# EAGLE design R2P_IR_module (EAGLE 6.2)
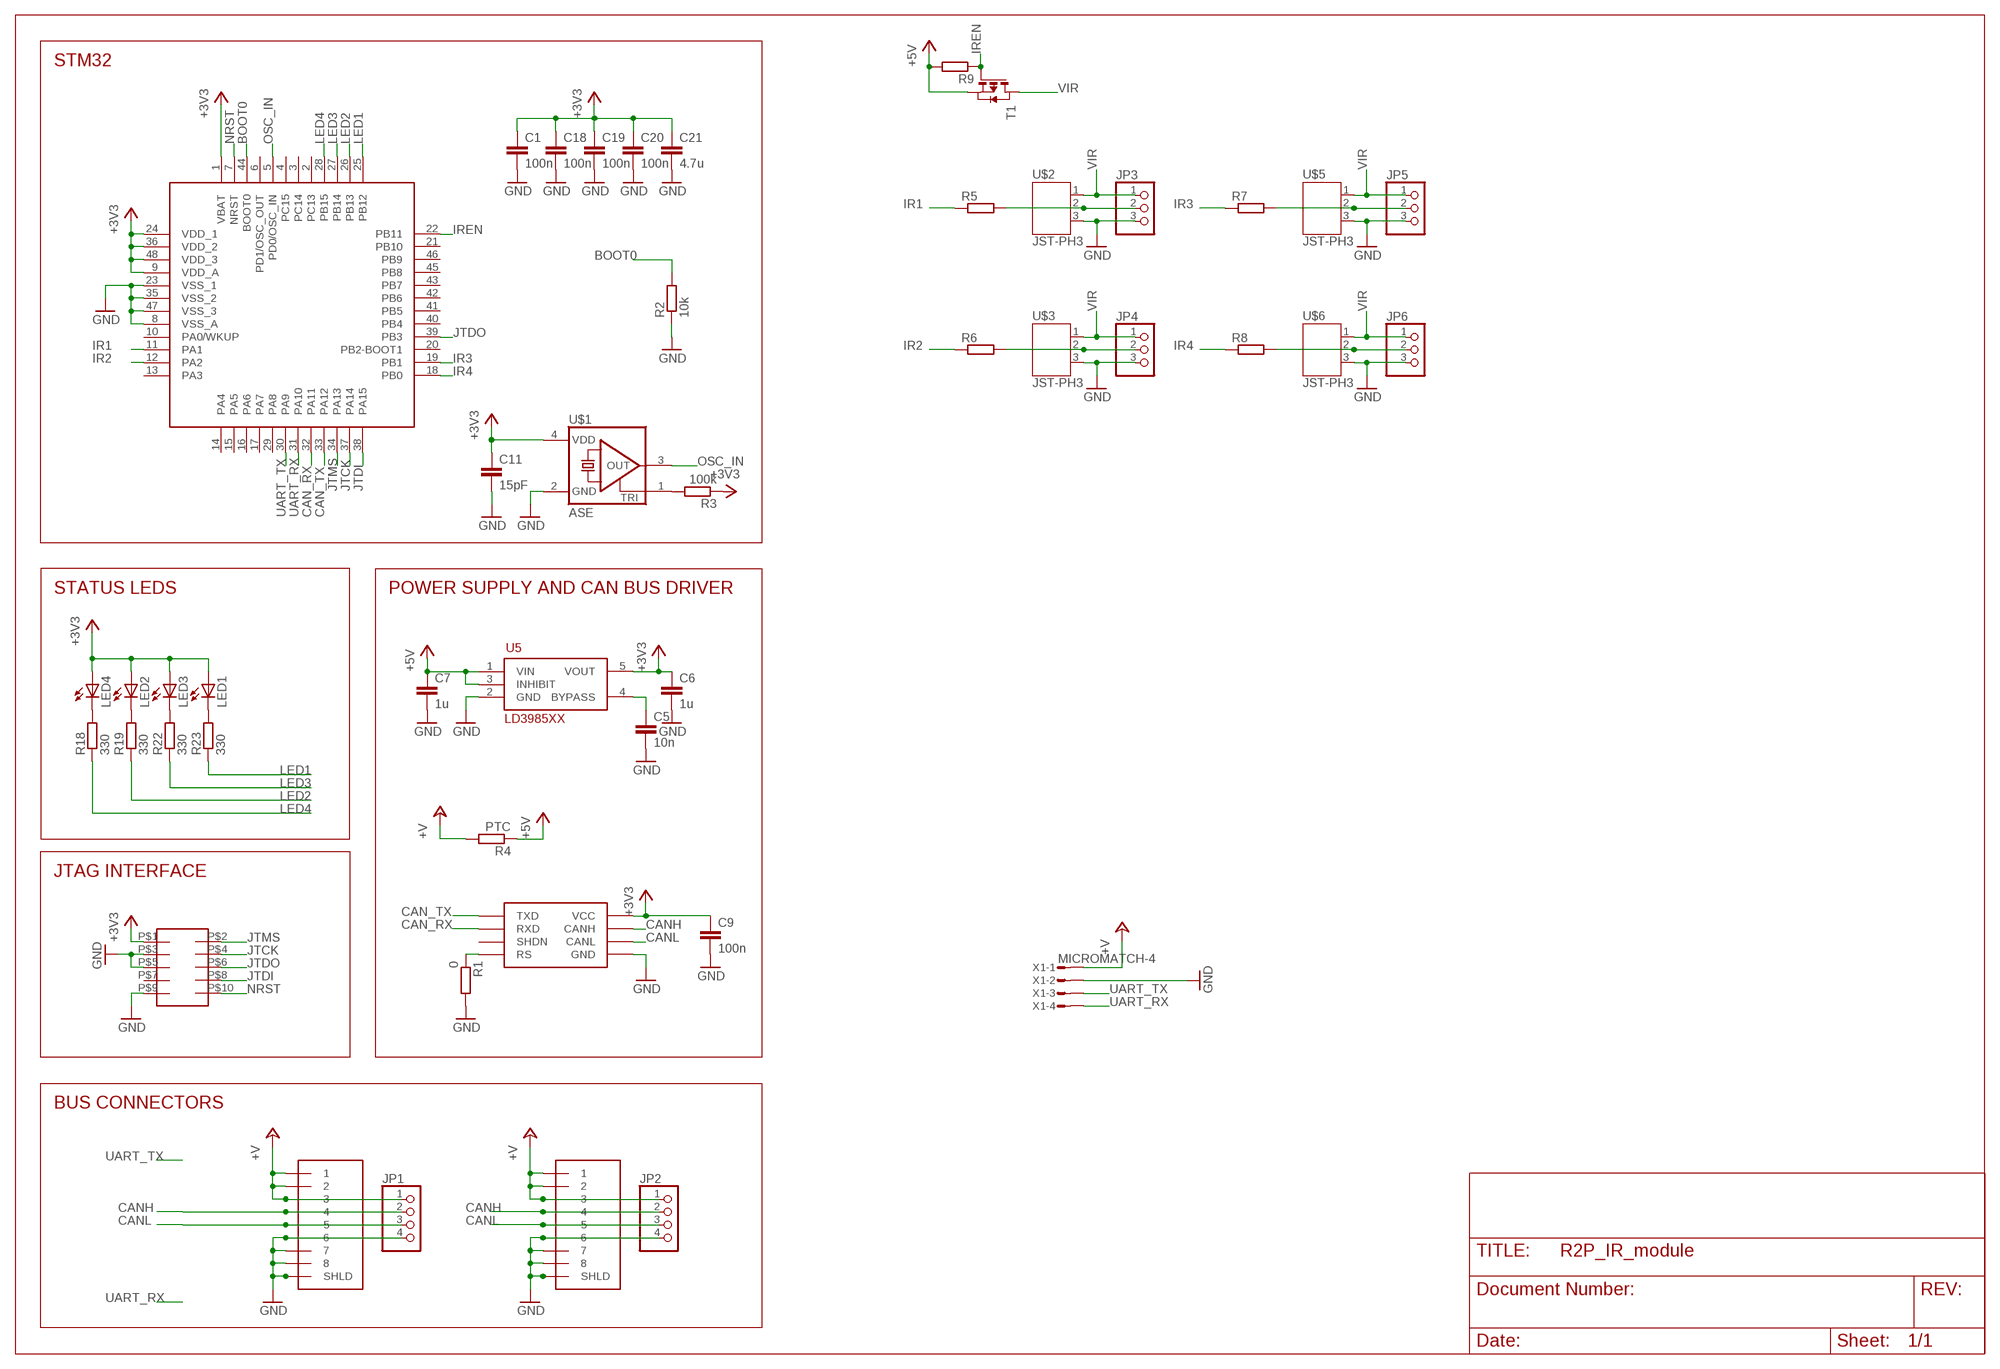
[diagram p0: schematic, sheet 1]

## Parts
1  RJ45-43860  [0438600010]
2  RJ45-43860  [0438600010]
C1  100n  C-EUC0603  [C0603]
C5  10n  C-EUC0603  [C0603]
C6  1u  C-EUC0603  [C0603]
C7  1u  C-EUC0603  [C0603]
C9  100n  C-EUC0603  [C0603]
C11  15pF  C-EUC0603  [C0603]
C18  100n  C-EUC0603  [C0603]
C19  100n  C-EUC0603  [C0603]
C20  100n  C-EUC0603  [C0603]
C21  4.7u  C-EUC0805  [C0805]
JP1  PINHD-1X4  [1X04]
JP2  PINHD-1X4  [1X04]
JP3  PINHD-1X3  [1X03]
JP4  PINHD-1X3  [1X03]
JP5  PINHD-1X3  [1X03]
JP6  PINHD-1X3  [1X03]
LED1  LEDCHIPLED_0805  [CHIPLED_0805]
LED2  LEDCHIPLED_0805  [CHIPLED_0805]
LED3  LEDCHIPLED_0805  [CHIPLED_0805]
LED4  LEDCHIPLED_0805  [CHIPLED_0805]
R1  0  R-EU_R0603  [R0603]
R2  10k  R-EU_R0603  [R0603]
R3  100k  R-EU_R0603  [R0603]
R4  PTC  R-EU_R0603  [R0603]
R5  R-EU_R0603  [R0603]
R6  R-EU_R0603  [R0603]
R7  R-EU_R0603  [R0603]
R8  R-EU_R0603  [R0603]
R9  R-EU_R0603  [R0603]
R18  330  R-EU_R0603  [R0603]
R19  330  R-EU_R0603  [R0603]
R22  330  R-EU_R0603  [R0603]
R23  330  R-EU_R0603  [R0603]
SOT1  MAX3051  [SOT23-8L]
T1  PMOSSOT23  [SOT-23]
U1  STM32F103CX  [LQFP48]
U5  LD3985XX  [SOT23-5L]
U$1  ASE  [ASE]
U$2  JST-PH3  [JST-PH3]
U$3  JST-PH3  [JST-PH3]
U$4  FTSH-105  [FTSH-105]
U$5  JST-PH3  [JST-PH3]
U$6  JST-PH3  [JST-PH3]
X1  MICROMATCH-4  [MICROMATCH-4]

## Nets
+3V3: C1.1 C6.1 C9.1 C11.1 C18.1 C19.1 C20.1 C21.1 LED1.A LED2.A LED3.A LED4.A R3.1 SOT1.P$3(VCC) U1.1(VBAT) U1.9(VDD_A) U1.24(VDD_1) U1.36(VDD_2) U1.48(VDD_3) U5.5(VOUT) U$1.4(VDD) U$4.P$1
+5V: C7.1 R4.1 R9.2 T1.2(S) U5.1(VIN) U5.3(INHIBIT)
+V: 1.P$1 1.P$2 1.P$3 2.P$1 2.P$2 2.P$3 JP1.1 JP2.1 R4.2 X1.1
BOOT0: R2.2 U1.44(BOOT0)
CAN_RX: SOT1.P$4(RXD) U1.32(PA11)
CAN_TX: SOT1.P$1(TXD) U1.33(PA12)
CANH: 1.P$4 2.P$4 JP1.2 JP2.2 SOT1.P$7(CANH)
CANL: 1.P$5 2.P$5 JP1.3 JP2.3 SOT1.P$6(CANL)
GND: 1.P$6 1.P$7 1.P$8 1.P$9(SHLD) 1.P$10 2.P$6 2.P$7 2.P$8 2.P$9(SHLD) 2.P$10 C1.2 C5.2 C6.2 C7.2 C9.2 C11.2 C18.2 C19.2 C20.2 C21.2 JP1.4 JP2.4 JP3.3 JP4.3 JP5.3 JP6.3 R1.2 R2.1 SOT1.P$2(GND) U1.8(VSS_A) U1.23(VSS_1) U1.35(VSS_2) U1.47(VSS_3) U5.2(GND) U$1.2(GND) U$2.3 U$3.3 U$4.P$3 U$4.P$5 U$4.P$9 U$5.3 U$6.3 X1.2
IR1: R5.1 U1.11(PA1)
IR2: R6.1 U1.12(PA2)
IR3: R7.1 U1.19(PB1)
IR4: R8.1 U1.18(PB0)
IREN: R9.1 T1.3(G) U1.22(PB11)
JTCK: U1.37(PA14) U$4.P$4
JTDI: U1.38(PA15) U$4.P$8
JTDO: U1.39(PB3) U$4.P$6
JTMS: U1.34(PA13) U$4.P$2
LED1: R23.1 U1.25(PB12)
LED2: R19.1 U1.26(PB13)
LED3: R22.1 U1.27(PB14)
LED4: R18.1 U1.28(PB15)
N$2: R1.1 SOT1.P$8(RS)
N$3: R3.2 U$1.1(TRI)
N$4: C5.1 U5.4(BYPASS)
N$5: JP3.2 R5.2 U$2.2
N$6: JP4.2 R6.2 U$3.2
N$7: JP6.2 R8.2 U$6.2
N$8: JP5.2 R7.2 U$5.2
N$15: LED4.C R18.2
N$18: LED2.C R19.2
N$20: LED3.C R22.2
N$22: LED1.C R23.2
NRST: U1.7(NRST) U$4.P$10
OSC_IN: U1.5(PD0/OSC_IN) U$1.3(OUT)
UART_RX: U1.31(PA10) X1.4
UART_TX: U1.30(PA9) X1.3
VIR: JP3.1 JP4.1 JP5.1 JP6.1 T1.1(D) U$2.1 U$3.1 U$5.1 U$6.1
Unconnected: SOT1.P$5(SHDN) U1.2(PC13) U1.3(PC14) U1.4(PC15) U1.6(PD1/OSC_OUT) U1.10(PA0/WKUP) U1.13(PA3) U1.14(PA4) U1.15(PA5) U1.16(PA6) U1.17(PA7) U1.20(PB2-BOOT1) U1.21(PB10) U1.29(PA8) U1.40(PB4) U1.41(PB5) U1.42(PB6) U1.43(PB7) U1.45(PB8) U1.46(PB9) U$4.P$7

## Notes on the sheet
- STM32
- STATUS LEDS | POWER SUPPLY AND CAN BUS DRIVER
- JTAG INTERFACE
- BUS CONNECTORS

## Library data of the parts
1 2 = molex:RJ45-43860
C1 C5-C7 C9 C11 C18-C21 = rcl:C-EU: CAPACITOR, European symbol
JP1 JP2 = misc:PINHD-1X4: PIN HEADER
JP3-JP6 = misc:PINHD-1X3: PIN HEADER
LED1-LED4 = led:LED: LED OSRAM: - CHIPLED LG R971, LG N971, LY N971, LG Q971, LY Q971, LO R971, LY R971 LH N974, LH R974 LS Q976, LO Q976, LY Q976 LO Q996 - Hyper CHIPLED LW Q18S LB Q993, LB Q99A, LB R99A - SideLED LS A670, LO A670, LY A670, LG A670, LP A670 LB A673, LV A673, LT A673, LW A673 LH A674 LY A675 LS A676, LA A676, LO A676, LY A676, LW A676 LS A679, LY A679, LG A679 - Hyper Micro SIDELED® LS Y876, LA Y876, LO Y876, LY Y876 LT Y87S - SmartLED LW L88C, LW L88S LB L89C, LB L89S, LG L890 LS L89K, LO L89K, LY L89K LS L896, LA L896, LO L896, LY L896 - TOPLED LS T670, LO T670, LY T670, LG T670, LP T670 LSG T670, LSP T670, LSY T670, LOP T670, LYG T670 LG T671, LOG T671, LSG T671 LB T673, LV T673, LT T673, LW T673 LH T674 LS T676, LA T676, LO T676, LY T676, LB T676, LH T676, LSB T676, LW T676 LB T67C, LV T67C, LT T67C, LS T67K, LO T67K, LY T67K, LW E67C LS E67B, LA E67B, LO E67B, LY E67B, LB E67C, LV E67C, LT E67C LW T67C LS T679, LY T679, LG T679 LS T770, LO T770, LY T770, LG T770, LP T770 LB T773, LV T773, LT T773, LW T773 LH T774 LS E675, LA E675, LY E675, LS T675 LS T776, LA T776, LO T776, LY T776, LB T776 LHGB T686 LT T68C, LB T68C - Hyper Mini TOPLED® LB M676 - Mini TOPLED Santana® LG M470 LS M47K, LO M47K, LY M47K Source: http://www.osram.convergy.de LUXEON: - LUMILED® LXK2-PW12-R00, LXK2-PW12-S00, LXK2-PW14-U00, LXK2-PW14-V00 LXK2-PM12-R00, LXK2-PM12-S00, LXK2-PM14-U00 LXK2-PE12-Q00, LXK2-PE12-R00, LXK2-PE12-S00, LXK2-PE14-T00, LXK2-PE14-U00 LXK2-PB12-K00, LXK2-PB12-L00, LXK2-PB12-M00, LXK2-PB14-N00, LXK2-PB14-P00, LXK2-PB14-Q00 LXK2-PR12-L00, LXK2-PR12-M00, LXK2-PR14-Q00, LXK2-PR14-R00 LXK2-PD12-Q00, LXK2-PD12-R00, LXK2-PD12-S00 LXK2-PH12-R00, LXK2-PH12-S00 LXK2-PL12-P00, LXK2-PL12-Q00, LXK2-PL12-R00 Source: www.luxeon.com KINGBRIGHT: KA-3528ASYC Source: www.kingbright.com
R1-R9 R18 R19 R22 R23 = rcl:R-EU_: RESISTOR, European symbol
SOT1 = maxim:MAX3051
T1 = zetex:PMOSSOT23: MOS FET; OC_FARNELL: unknown; OC_NEWARK: unknown
U1 = st:STM32F103CX
U5 = st:LD3985XX
U$1 = crystal:ASE: 3.3Vdc CMOS SMD CRYSTAL CLOCK OSCILLATOR SOurce: www.abracon.com; OC_FARNELL: unknown; OC_NEWARK: unknown
U$2 U$3 U$5 U$6 = jst:JST-PH3
U$4 = samtec:FTSH-105
X1 = tyco:MICROMATCH-4: MicroMaTch 4

## Board
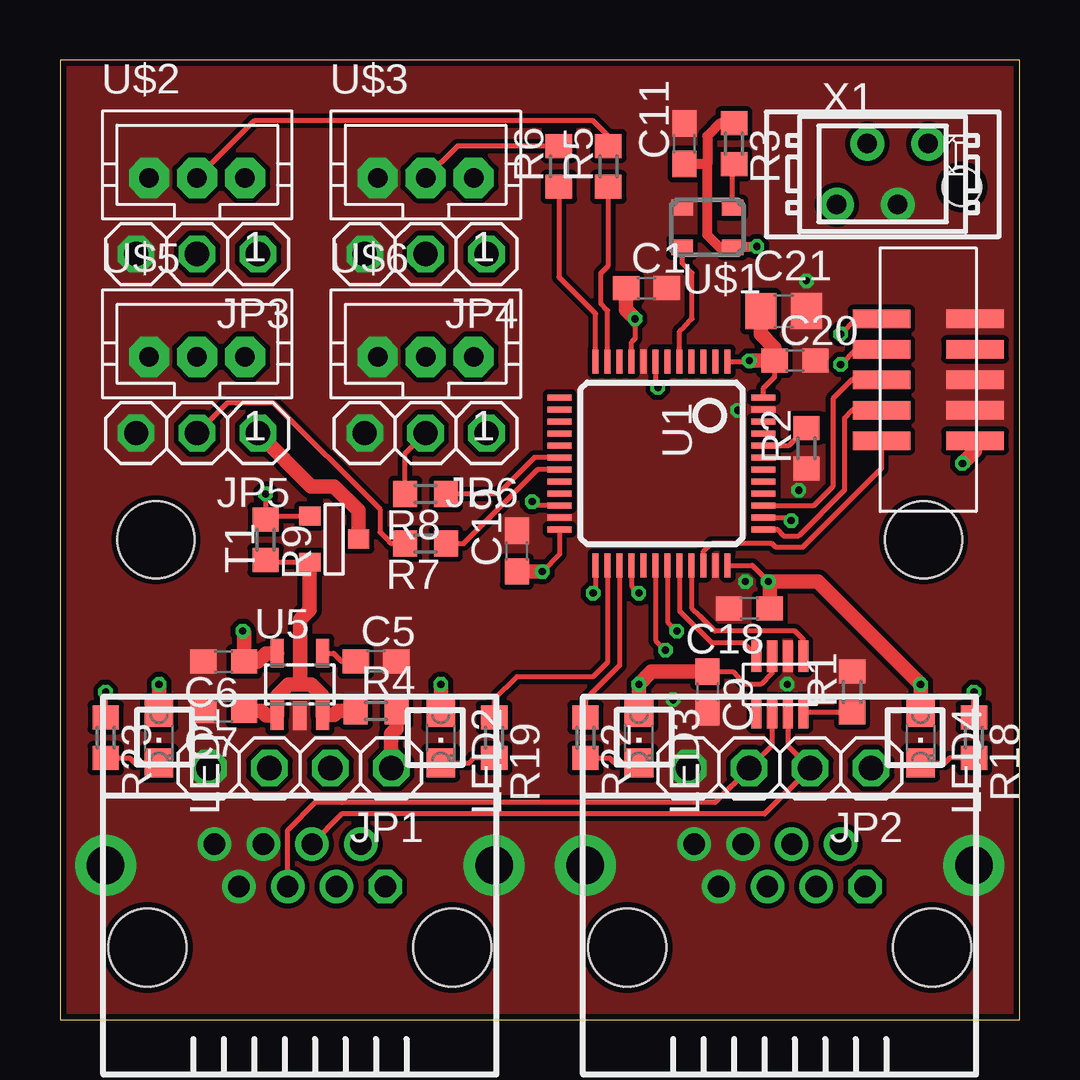
[diagram p1: board, top side]
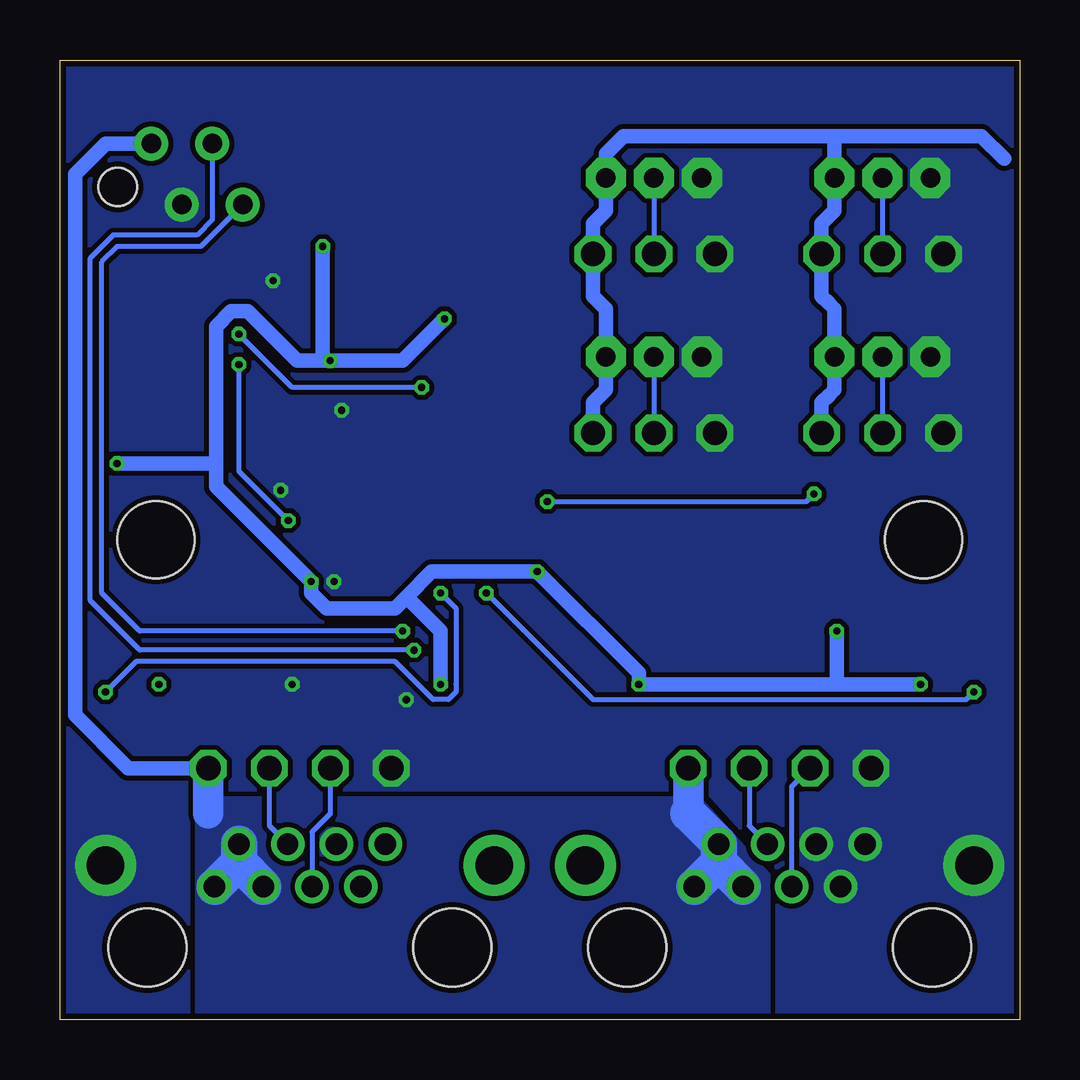
[diagram p2: board, bottom side, seen from below]

Size 40 x 40 mm. Coordinates in mm from the lower left corner, seen from the top.
Outline: 0,0 40,0 40,40 0,40 0,0
Copper layers (1*16): Top 0.035mm / dielectric 1.5mm / Bottom 0.035mm
Design rules: minimum track width 8mil, minimum drill 0.3mm, track to track 8mil, track to pad 8mil, pad to pad 8mil, via to via 8mil, smd to smd 0mil, copper to edge 10mil, drill to drill 10mil, minimum pad ring 10mil, minimum via ring 6mil, stop-mask expansion 2mil, vias tented up to drill 100mil, thermal gap 10mil
Holes 3.2 mm at 4,20 36,20

### Footprints (pad centres in the part's own frame; a part is rotated, then mirrored left to right if it is on the bottom)
0438600010 = drill 0.889 octagon: P$1 3.556,2.54 | drill 0.889: P$2 2.54,4.318; P$3 1.524,2.54; P$4 0.508,4.318; P$5 -0.508,2.54; P$6 -1.524,4.318; P$7 -2.54,2.54; P$8 -3.556,4.318 | drill 1.575 pad 2.54: P$9 8.103,3.429; P$10 -8.103,3.429 | hole 3.251: -6.35,0; 6.35,0
C0603 = smd 1.1 x 1: 1 -0.85,0; 2 0.85,0
C0805 = smd 1.3 x 1.5: 1 -0.95,0; 2 0.95,0
1X04 = drill 1.016 octagon: 1 -3.81,0; 2 -1.27,0; 3 1.27,0; 4 3.81,0
1X03 = drill 1.016 octagon: 1 -2.54,0; 2 0,0; 3 2.54,0
CHIPLED_0805 = smd 1.2 x 1.2: A 0,-1.05; C 0,1.05
R0603 = smd 1 x 1.1: 1 -0.85,0; 2 0.85,0
SOT23-8L = smd 1.3 x 0.42: P$1 -1.175,1.3; P$2 -1.175,0.65; P$3 -1.175,0; P$4 -1.175,-0.65; P$5 1.175,-0.65; P$6 1.175,0; P$7 1.175,0.65; P$8 1.175,1.3
SOT-23 = smd 0.787 x 0.889: 1 0.025,-1.016; 2 -0.94,1.016; 3 0.991,1.016
LQFP48 = smd 1 x 0.25: 1 -4.25,2.75; 2 -4.25,2.25; 3 -4.25,1.75; 4 -4.25,1.25; 5 -4.25,0.75; 6 -4.25,0.25; 7 -4.25,-0.25; 8 -4.25,-0.75; 9 -4.25,-1.25; 10 -4.25,-1.75; 11 -4.25,-2.25; 12 -4.25,-2.75; 25 4.25,-2.75; 26 4.25,-2.25; 27 4.25,-1.75; 28 4.25,-1.25; 29 4.25,-0.75; 30 4.25,-0.25; 31 4.25,0.25; 32 4.25,0.75; 33 4.25,1.25; 34 4.25,1.75; 35 4.25,2.25; 36 4.25,2.75 | smd 0.25 x 1: 13 -2.75,-4.25; 14 -2.25,-4.25; 15 -1.75,-4.25; 16 -1.25,-4.25; 17 -0.75,-4.25; 18 -0.25,-4.25; 19 0.25,-4.25; 20 0.75,-4.25; 21 1.25,-4.25; 22 1.75,-4.25; 23 2.25,-4.25; 24 2.75,-4.25; 37 2.75,4.25; 38 2.25,4.25; 39 1.75,4.25; 40 1.25,4.25; 41 0.75,4.25; 42 0.25,4.25; 43 -0.25,4.25; 44 -0.75,4.25; 45 -1.25,4.25; 46 -1.75,4.25; 47 -2.25,4.25; 48 -2.75,4.25
SOT23-5L = smd 0.55 x 1.2: 1 -0.95,-1.3; 2 0,-1.3; 3 0.95,-1.3; 4 0.95,1.3; 5 -0.95,1.3
ASE = smd 0.9 x 0.65: 1 -1.05,-0.825; 2 1.05,-0.825; 3 1.05,0.825; 4 -1.05,0.825
JST-PH3 = drill 0.813 pad 1.676 octagon: 1 2,0; 2 0,0; 3 -2,0
FTSH-105 = smd 0.76 x 2.4: P$1 -2.54,-1.95; P$2 -2.54,1.95; P$3 -1.27,-1.95; P$4 -1.27,1.95; P$5 0,-1.95; P$6 0,1.95; P$7 1.27,-1.95; P$8 1.27,1.95; P$9 2.54,-1.95; P$10 2.54,1.95
MICROMATCH-4 = drill 0.813 pad 1.422: 1 1.905,1.27; 2 0.635,-1.27; 3 -0.635,1.27; 4 -1.905,-1.27 | hole 1.6: 3.305,-0.53

### Placement (x,y rotation side)
1  30,3 0 top
2  10,3 0 top
C1  24.45,30.48 0 top
C5  13.18,14.92 0 top
C6  6.83,14.92 180 top
C7  6.83,12.86 180 top
C9  26.99,13.65 270 top
C11  26.04,36.51 90 top
C18  28.73,17.14 180 top
C19  19.05,19.53 90 top
C20  30.64,27.46 0 top
C21  30.16,29.53 0 top
JP1  10,10.48 180 top
JP2  30,10.48 180 top
JP3  5.71,31.91 180 top
JP4  15.24,31.91 180 top
JP5  5.71,24.45 180 top
JP6  15.24,24.45 180 top
LED1  4.13,11.75 180 top
LED2  15.88,11.75 180 top
LED3  24.13,11.75 180 top
LED4  35.88,11.75 180 top
R1  33.02,13.65 90 top
R2  31.11,23.81 90 top
R3  28.1,36.51 270 top
R4  13.18,12.86 0 top
R5  22.86,35.56 90 top
R6  20.8,35.56 90 top
R7  15.24,19.84 180 top
R8  15.24,21.91 180 top
R9  8.57,20 270 top
R18  38.1,11.75 270 top
R19  18.1,11.75 270 top
R22  21.91,11.75 270 top
R23  1.91,11.75 270 top
SOT1  29.69,13.97 270 top
T1  11.43,20 90 top
U1  25.08,23.18 270 top
U5  10,13.97 0 top
U$1  26.99,33.02 180 top
U$2  5.71,35.08 0 top
U$3  15.24,35.08 0 top
U$4  36.2,26.67 90 top
U$5  5.71,27.62 0 top
U$6  15.24,27.62 0 top
X1  34.29,35.24 0 top

### Tracks (layer width: path | path; a pad name or v marks a point on that pad's centre or on a via)
+3V3  (via drill 0.3)
  Top 0.203: SOT1.P$3 29.69,14.45 29.21,13.97 28.57,13.97 28.26,14.29 28.04,14.5 C9.1 | 8.6,15.27 8.57,15.24 | U1.24 20.83,19.4 v20.11,18.68 | U1.36 28.86,18.93 v29.53,18.26 | v23.97,29.21 23.97,28.42 23.97,28.38 23.83,28.24 U1.9 | U1.1 28.7,27.43 v28.73,27.46 | U1.48 29.33,26.32 29.79,26.77 C20.1
  Top 0.406: 26.99,35.66 26.99,32.7 27.5,32.2 U$1.4 28.07,32.23 v29.05,32.23 | 26.99,35.66 C11.1 | R3.1 27.52,37.36 26.99,36.83 26.99,35.66
  Top 0.61: U5.5 8.6,15.27 | 8.57,15.24 8.26,14.92 C6.1 7.68,16.14 v7.62,16.19 | LED1.A v4.13,13.97 | LED2.A v15.88,13.97 | LED3.A v24.13,13.97 24.66,14.5 C9.1 | LED4.A v35.88,13.97 31.59,18.26 v29.53,18.26 29.58,18.26 C18.1 | C1.1 23.6,29.58 v23.97,29.21 | C19.1 v20.11,18.68 | v37.62,23.18 38.15,23.7 38.15,24.02 U$4.P$1 | v28.73,27.46 C20.1 29.79,28 29.21,28.57 C21.1
  Bottom 0.61: 7.62,13.97 v7.62,16.19 | v4.13,13.97 7.62,13.97 | 7.62,13.97 v15.88,13.97 15.88,14.45 v20.11,18.68 24.5,18.68 25.56,17.62 | 33.5,23.18 33.5,22.23 v29.53,18.26 29.53,17.78 28.89,17.14 26.04,17.14 25.56,17.62 | 33.5,23.18 33.5,28.89 32.86,29.53 32.7,29.53 32.17,29.53 30.11,27.46 v28.73,27.46 | v37.62,23.18 33.5,23.18 | v24.13,13.97 24.13,16.19 25.56,17.62 | v28.73,27.46 25.72,27.46 v23.97,29.21 | v29.05,32.23 29.05,27.46 v28.73,27.46
+5V
  Top 0.203: 8.6,12.67 8.57,12.7 | R9.2 8.66,19.06 T1.2
  Top 0.61: 8.6,12.67 U5.1 9.05,13.5 9.53,13.97 10,13.97 | C7.1 8.41,12.86 8.57,12.7 | 10,13.97 10.48,13.97 10.95,13.5 U5.3 10.98,12.7 11.43,12.7 11.59,12.86 R4.1 | 10,13.97 10,16.67 10.41,17.08 T1.2
+V
  Top 0.61: JP1.1 13.81,11.9 13.97,12.06 14.03,12.12 R4.2
  Bottom 0.61: X1.1 38.1,36.51 39.37,35.24 39.37,33.97 39.37,12.7 37.15,10.48 JP2.1
  Bottom 1.27: JP2.1 33.81,8.59 | JP1.1 13.81,8.59 2.P$2
  Bottom 1.524: 1.P$1 32.54,6.56 | 32.54,6.56 1.P$2 32.54,6.56 | 1.P$3 32.54,6.56 | 13.81,8.59 2.P$2 | 2.P$2 12.54,6.56 | 12.54,6.56 2.P$1 | 2.P$3 12.54,6.56 | 12.54,6.56 2.P$2
  pour Bottom (no thermals): 10.48,0 10.48,6.03 13.34,9.21 34.29,9.21 34.29,0
BOOT0
  Top 0.203: U1.44 30.38,23.93 R2.2
CAN_RX
  Top 0.203: U1.32 25.83,17.03 27.15,15.72 28.46,15.72 SOT1.P$4
CAN_TX
  Top 0.203: U1.33 26.33,17.16 26.67,16.83 27.3,16.19 30.64,16.19 30.99,15.85 SOT1.P$1
CANH
  Top 0.203: 2.P$4 10.51,7.33 11.75,8.57 29.37,8.57 JP2.2 30.34,11.41 SOT1.P$7
  Bottom 0.203: JP1.2 11.27,8.08 2.P$4 | JP2.2 31.27,8.08 1.P$4
CANL
  Top 0.203: SOT1.P$6 29.69,11.43 JP2.3 27.3,9.05 11.75,9.05 10.64,9.05 9.53,7.94 9.49,7.9 2.P$5
  Bottom 0.203: 1.P$5 29.49,7.81 28.73,8.57 JP2.3 | 2.P$5 9.49,9.72 JP1.3
GND  (via drill 0.3)
  other vias: 30.8,22.07 30.32,13.97 31.11,30.8 28.57,18.26 28.26,25.4 25.56,13.34
  pour Bottom (rank 6, no thermals): 0,0 40,0 40,40 0,40
  pour Top (rank 6, no thermals): 0,0 40,0 40,40 0,40
IR1
  Top 0.203: U1.11 22.83,29.55 22.54,29.84 22.54,31.11 22.86,31.43 R5.1
IR2
  Top 0.203: U1.12 22.33,29.42 20.95,30.8 20.8,30.96 R6.1
IR3
  Top 0.203: U1.19 19.91,22.93 16.83,19.84 R7.1
IR4
  Top 0.203: U1.18 19.78,23.43 18.26,21.91 R8.1
IREN  (via drill 0.3)
  Top 0.203: T1.3 8.71,20.99 R9.1 v8.57,21.91 | U1.22 19.85,21.43 v19.68,21.59
  Bottom 0.203: v19.68,21.59 8.89,21.59 v8.57,21.91
JTCK
  Top 0.203: U1.37 29.9,20.43 30.16,20.16 30.8,20.16 32.7,22.07 32.7,25.08 33.02,25.4 33.18,25.4 U$4.P$4
JTDI  (via drill 0.3)
  Top 0.203: U$4.P$8 33.18,27.94 v32.54,27.3 | U1.38 30.35,20.93 v30.48,20.8
  Bottom 0.203: v32.54,27.3 32.54,22.86 v30.48,20.8
JTDO
  Top 0.203: U$4.P$6 33.02,26.67 32.23,25.88 32.23,22.23 31.43,21.43 U1.39
JTMS
  Top 0.203: U1.34 26.83,19.53 27.15,19.84 29.69,19.84 29.84,19.68 30.96,19.68 34.24,22.97 U$4.P$2
LED1  (via drill 0.3)
  Top 0.203: U1.25 22.33,17.89 v22.23,17.78 | R23.1 v1.91,13.65
  Bottom 0.203: v22.23,17.78 17.78,13.34 2.54,13.34 2.22,13.34 v1.91,13.65
LED2
  Top 0.203: U1.26 22.83,14.89 22.23,14.29 19.05,14.29 18.1,13.34 R19.1
LED3
  Top 0.203: U1.27 23.33,14.76 21.91,13.34 R22.1
LED4  (via drill 0.3)
  Top 0.203: U1.28 23.83,18.08 v24.13,17.78 | R18.1 v38.1,13.65
  Bottom 0.203: v24.13,17.78 23.5,17.14 23.5,13.97 23.5,13.65 23.81,13.34 24.45,13.34 24.77,13.65 26.04,14.92 36.83,14.92 v38.1,13.65
N$2
  Top 0.203: R1.1 30.99,12.8 SOT1.P$8
N$3
  Top 0.203: U$1.1 28.04,35.6 R3.2
N$4
  Top 0.203: U5.4 11.4,15.27 11.43,15.24 11.75,14.92 C5.1
N$5
  Top 0.203: R5.2 22.86,36.83 22.23,37.47 8.1,37.47 U$2.2
  Bottom 0.203: U$2.2 JP3.2
N$6
  Top 0.203: R6.2 16.57,36.41 U$3.2
  Bottom 0.203: U$3.2 JP4.2
N$7
  Top 0.203: R8.2 14.39,23.6 JP6.2
  Bottom 0.203: U$6.2 JP6.2
N$8
  Top 0.203: JP5.2 6.99,25.72 8.89,25.72 13.34,21.27 13.34,20.32 13.65,20 13.81,19.84 R7.2
  Bottom 0.203: U$5.2 JP5.2
N$15
  Top 0.203: LED4.C 36.89,10.7 37.09,10.9 R18.2
N$18
  Top 0.203: LED2.C 17.05,10.7 17.25,10.9 R19.2
N$20
  Top 0.203: R22.2 22.92,10.9 23.12,10.7 LED3.C
N$22
  Top 0.203: LED1.C 3.11,10.7 2.91,10.9 R23.2
NRST  (via drill 0.3)
  Top 0.203: U1.7 24.83,26.44 v24.92,26.35 | U$4.P$10 33.18,29.21 v32.54,28.57
  Bottom 0.203: v24.92,26.35 30.32,26.35 v32.54,28.57
OSC_IN
  Top 0.203: U1.5 25.83,28.69 26.04,28.89 26.35,29.21 26.35,31.11 25.94,31.53 U$1.3
UART_RX  (via drill 0.3)
  Top 0.203: U1.31 25.33,16.58 v25.72,16.19
  Bottom 0.203: v25.72,16.19 36.67,16.19 38.26,17.78 38.26,31.59 37.62,32.23 34.13,32.23 X1.4
UART_TX  (via drill 0.3)
  Top 0.203: U1.30 24.83,16.12 24.83,15.81 v25.24,15.4
  Bottom 0.203: v25.24,15.4 36.67,15.4 38.73,17.46 38.73,31.75 37.78,32.7 34.29,32.7 33.66,33.34 X1.3
VIR
  Top 0.61: JP5.1 10.48,22.23 11.43,22.23 12.45,21.21 T1.1
  Bottom 0.61: JP5.1 8.26,25.72 7.94,26.04 7.71,26.26 U$5.1 7.71,29.62 7.94,29.84 8.26,30.16 JP3.1 8.26,33.18 7.71,33.72 U$2.1 7.71,36.73 7.62,36.83 | JP6.1 17.78,25.72 17.24,26.26 U$6.1 17.24,29.62 17.46,29.84 17.78,30.16 JP4.1 17.78,33.18 17.24,33.72 U$3.1 17.24,36.1 16.51,36.83 16.19,36.83 15.56,36.83 7.94,36.83 | 0.64,35.88 1.59,36.83 7.62,36.83 | 7.62,36.83 7.94,36.83 | 7.71,36.83 7.94,36.83